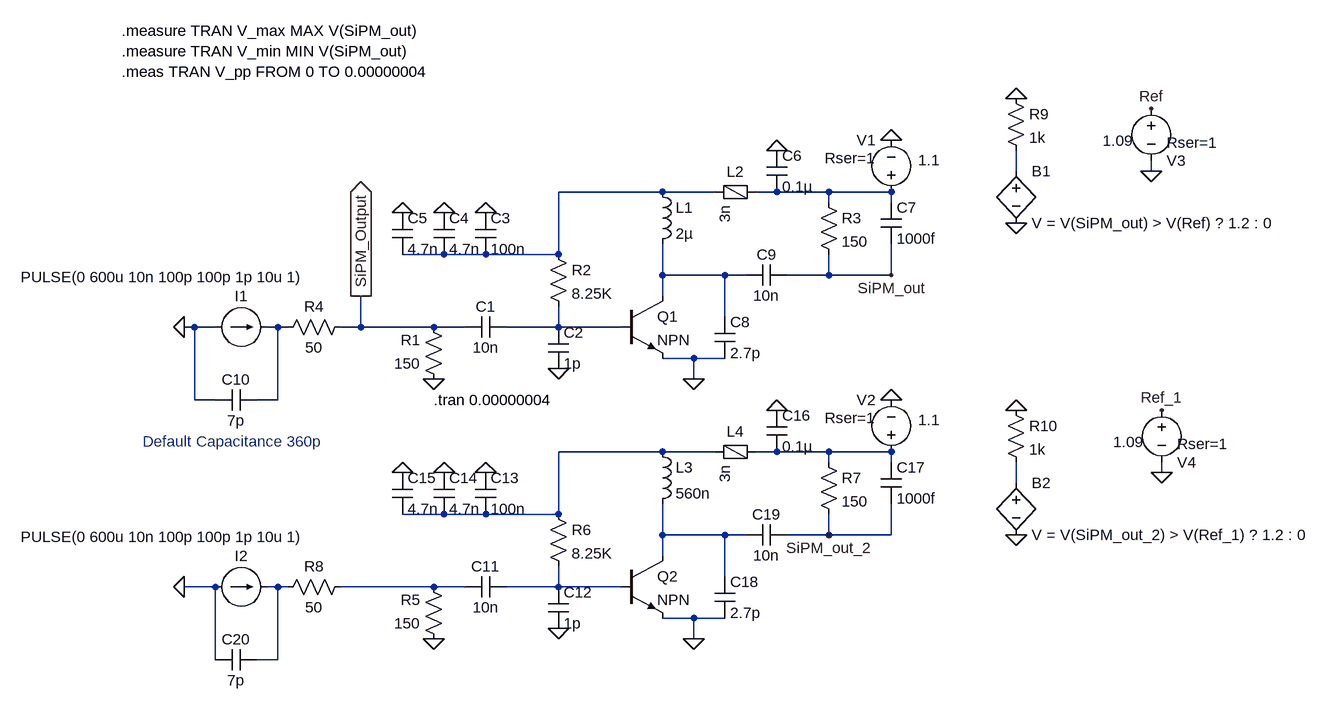
[diagram p0: schematic FARICH_TOT_Simulation.asc]
FARICH_TOT_Simulation.asc, the LTspice schematic file:
Version 4
SHEET 1 1384 896
WIRE 896 -80 896 -112
WIRE 1104 -80 1104 -96
WIRE 352 -48 192 -48
WIRE 432 -48 352 -48
WIRE 528 -48 496 -48
WIRE 608 -48 528 -48
WIRE 704 -48 608 -48
WIRE 608 -32 608 -48
WIRE 704 -32 704 -48
WIRE 16 48 -48 48
WIRE 80 48 16 48
WIRE 192 48 192 -48
WIRE 192 48 80 48
WIRE 352 80 352 32
WIRE 448 80 352 80
WIRE 480 80 448 80
WIRE 608 80 608 48
WIRE 608 80 544 80
WIRE 704 80 704 32
WIRE 704 80 608 80
WIRE 352 112 352 80
WIRE 448 144 448 80
WIRE -368 160 -384 160
WIRE -336 160 -368 160
WIRE -240 160 -256 160
WIRE -224 160 -240 160
WIRE -112 160 -112 112
WIRE -112 160 -144 160
WIRE 0 160 -112 160
WIRE 48 160 0 160
WIRE 192 160 192 128
WIRE 192 160 112 160
WIRE 288 160 192 160
WIRE 400 208 352 208
WIRE 448 208 400 208
WIRE 400 240 400 208
WIRE -368 272 -368 160
WIRE -336 272 -368 272
WIRE -240 272 -240 160
WIRE -240 272 -272 272
WIRE 352 352 192 352
WIRE 432 352 352 352
WIRE 528 352 496 352
WIRE 608 352 528 352
WIRE 704 352 608 352
WIRE 608 368 608 352
WIRE 704 368 704 352
WIRE 1120 384 1120 368
WIRE 896 400 896 368
WIRE 16 448 -48 448
WIRE 80 448 16 448
WIRE 192 448 192 352
WIRE 192 448 80 448
WIRE 352 480 352 432
WIRE 448 480 352 480
WIRE 480 480 448 480
WIRE 608 480 608 448
WIRE 608 480 544 480
WIRE 704 480 704 432
WIRE 704 480 608 480
WIRE 352 512 352 480
WIRE 448 544 448 480
WIRE -336 560 -384 560
WIRE -240 560 -256 560
WIRE -224 560 -240 560
WIRE 0 560 -144 560
WIRE 48 560 0 560
WIRE 192 560 192 528
WIRE 192 560 112 560
WIRE 288 560 192 560
WIRE 400 608 352 608
WIRE 448 608 400 608
WIRE 400 640 400 608
WIRE -336 672 -336 560
WIRE -240 672 -240 560
WIRE -240 672 -272 672
FLAG 400 240 0
FLAG 192 224 0
FLAG 0 240 0
FLAG -48 -16 0
FLAG 16 -16 0
FLAG 80 -16 0
FLAG 528 -112 0
FLAG 704 -128 0
FLAG -384 160 0
FLAG 400 640 0
FLAG 192 624 0
FLAG 0 640 0
FLAG -48 384 0
FLAG 16 384 0
FLAG 80 384 0
FLAG 528 288 0
FLAG 704 272 0
FLAG -384 560 0
FLAG 704 80 SiPM_out
FLAG 1104 -80 0
FLAG 1104 -176 Ref
FLAG 896 0 0
FLAG 896 -192 0
FLAG 608 480 SiPM_out_2
FLAG 896 480 0
FLAG 896 288 0
FLAG 1120 384 0
FLAG 1120 288 Ref_1
FLAG -112 112 SiPM_Output
IOPIN -112 112 Out
SYMBOL npn3 288 112 R0
SYMATTR InstName Q1
SYMBOL res 16 256 R180
WINDOW 0 36 76 Left 2
WINDOW 3 36 40 Left 2
SYMATTR InstName R1
SYMATTR Value 150
SYMBOL cap 112 144 R90
WINDOW 0 0 32 VBottom 2
WINDOW 3 32 32 VTop 2
SYMATTR InstName C1
SYMATTR Value 10n
SYMBOL res 176 32 R0
SYMATTR InstName R2
SYMATTR Value 8.25K
SYMATTR SpiceLine tol=1 pwr=0.1
SYMBOL cap 176 160 R0
SYMATTR InstName C2
SYMATTR Value 1p
SYMATTR SpiceLine V=25 Irms=0 Rser=0.734 Lser=380p mfg="W�rth Elektronik" pn="885012005034 WCAP-CSGP 0402" type="NP0"
SYMBOL cap 64 -16 R0
SYMATTR InstName C3
SYMATTR Value 100n
SYMBOL cap 0 -16 R0
SYMATTR InstName C4
SYMATTR Value 4.7n
SYMBOL cap -64 -16 R0
SYMATTR InstName C5
SYMATTR Value 4.7n
SYMBOL ind 336 -64 R0
SYMATTR InstName L1
SYMATTR Value 2µ
SYMATTR SpiceLine Ipk=1.3 Rser=0.095 Rpar=2487.88 Cpar=0 mfg="Bourns, Inc." pn="SRU3014-2R0Y"
SYMBOL cap 512 -112 R0
SYMATTR InstName C6
SYMATTR Value 0.1µ
SYMATTR SpiceLine V=4 Irms=0 Rser=0 Lser=0 mfg="Murata" pn="GRM022R60G153KE15" type="X5R"
SYMBOL res 592 -48 R0
SYMATTR InstName R3
SYMATTR Value 150
SYMATTR SpiceLine tol=1 pwr=0.1
SYMBOL cap 688 -32 R0
SYMATTR InstName C7
SYMATTR Value 1000f
SYMATTR SpiceLine V=25 Irms=0 Rser=0.734 Lser=380p mfg="W�rth Elektronik" pn="885012005034 WCAP-CSGP 0402" type="NP0"
SYMBOL cap 432 144 R0
SYMATTR InstName C8
SYMATTR Value 2.7p
SYMATTR SpiceLine V=25 Irms=0 Rser=0 Lser=0
SYMBOL cap 544 64 R90
WINDOW 0 0 32 VBottom 2
WINDOW 3 32 32 VTop 2
SYMATTR InstName C9
SYMATTR Value 10n
SYMATTR SpiceLine V=6.3 Irms=25.7m Rser=3.62516 Lser=0
SYMBOL voltage 704 -32 R180
WINDOW 0 24 96 Left 2
WINDOW 3 -75 65 Left 2
WINDOW 123 0 0 Left 0
WINDOW 39 24 68 Left 2
SYMATTR InstName V1
SYMATTR Value 1.1
SYMATTR SpiceLine Rser=1
SYMBOL FerriteBead 464 -48 R90
WINDOW 0 -16 0 VBottom 2
SYMATTR InstName L2
SYMATTR Value 3n
SYMATTR SpiceLine Ipk=2 Rser=0.064 Rpar=620 Cpar=1.1p mfg="W�rth Elektronik" pn="782763621 WE-CBA 1206"
SYMBOL current -336 160 R270
WINDOW 0 32 40 VTop 2
WINDOW 3 93 -80 VBottom 2
WINDOW 123 0 0 Left 0
WINDOW 39 0 0 Left 0
SYMATTR InstName I1
SYMATTR Value PULSE(0 600u 10n 100p 100p 1p 10u 1)
SYMBOL res -128 144 R90
WINDOW 0 0 56 VBottom 2
WINDOW 3 32 56 VTop 2
SYMATTR InstName R4
SYMATTR Value 50
SYMBOL cap -272 256 R90
WINDOW 0 0 32 VBottom 2
WINDOW 3 32 32 VTop 2
SYMATTR InstName C10
SYMATTR Value 7p
SYMBOL npn3 288 512 R0
SYMATTR InstName Q2
SYMBOL res 16 656 R180
WINDOW 0 36 76 Left 2
WINDOW 3 36 40 Left 2
SYMATTR InstName R5
SYMATTR Value 150
SYMBOL cap 112 544 R90
WINDOW 0 0 32 VBottom 2
WINDOW 3 32 32 VTop 2
SYMATTR InstName C11
SYMATTR Value 10n
SYMBOL res 176 432 R0
SYMATTR InstName R6
SYMATTR Value 8.25K
SYMATTR SpiceLine tol=1 pwr=0.1
SYMBOL cap 176 560 R0
SYMATTR InstName C12
SYMATTR Value 1p
SYMATTR SpiceLine V=25 Irms=0 Rser=0.734 Lser=380p mfg="W�rth Elektronik" pn="885012005034 WCAP-CSGP 0402" type="NP0"
SYMBOL cap 64 384 R0
SYMATTR InstName C13
SYMATTR Value 100n
SYMBOL cap 0 384 R0
SYMATTR InstName C14
SYMATTR Value 4.7n
SYMBOL cap -64 384 R0
SYMATTR InstName C15
SYMATTR Value 4.7n
SYMBOL ind 336 336 R0
SYMATTR InstName L3
SYMATTR Value 560n
SYMATTR SpiceLine Ipk=1.3 Rser=0.095 Rpar=2487.88 Cpar=0
SYMBOL cap 512 288 R0
SYMATTR InstName C16
SYMATTR Value 0.1µ
SYMATTR SpiceLine V=4 Irms=0 Rser=0 Lser=0 mfg="Murata" pn="GRM022R60G153KE15" type="X5R"
SYMBOL res 592 352 R0
SYMATTR InstName R7
SYMATTR Value 150
SYMATTR SpiceLine tol=1 pwr=0.1
SYMBOL cap 688 368 R0
SYMATTR InstName C17
SYMATTR Value 1000f
SYMATTR SpiceLine V=25 Irms=0 Rser=0.734 Lser=380p mfg="W�rth Elektronik" pn="885012005034 WCAP-CSGP 0402" type="NP0"
SYMBOL cap 432 544 R0
SYMATTR InstName C18
SYMATTR Value 2.7p
SYMATTR SpiceLine V=25 Irms=0 Rser=0 Lser=0
SYMBOL cap 544 464 R90
WINDOW 0 0 32 VBottom 2
WINDOW 3 32 32 VTop 2
SYMATTR InstName C19
SYMATTR Value 10n
SYMATTR SpiceLine V=6.3 Irms=25.7m Rser=3.62516 Lser=0
SYMBOL voltage 704 368 R180
WINDOW 0 24 96 Left 2
WINDOW 3 -75 65 Left 2
WINDOW 123 0 0 Left 0
WINDOW 39 24 68 Left 2
SYMATTR InstName V2
SYMATTR Value 1.1
SYMATTR SpiceLine Rser=1
SYMBOL FerriteBead 464 352 R90
WINDOW 0 -16 0 VBottom 2
SYMATTR InstName L4
SYMATTR Value 3n
SYMATTR SpiceLine Ipk=2 Rser=0.064 Rpar=620 Cpar=1.1p mfg="W�rth Elektronik" pn="782763621 WE-CBA 1206"
SYMBOL current -336 560 R270
WINDOW 0 32 40 VTop 2
WINDOW 3 93 -80 VBottom 2
WINDOW 123 0 0 Left 0
WINDOW 39 0 0 Left 0
SYMATTR InstName I2
SYMATTR Value PULSE(0 600u 10n 100p 100p 1p 10u 1)
SYMBOL res -128 544 R90
WINDOW 0 0 56 VBottom 2
WINDOW 3 32 56 VTop 2
SYMATTR InstName R8
SYMATTR Value 50
SYMBOL cap -272 656 R90
WINDOW 0 0 32 VBottom 2
WINDOW 3 32 32 VTop 2
SYMATTR InstName C20
SYMATTR Value 7p
SYMBOL bv 896 -96 R0
SYMATTR InstName B1
SYMATTR Value V = V(SiPM_out) > V(Ref) ? 1.2 : 0
SYMBOL voltage 1104 -192 R0
WINDOW 0 24 96 Left 2
WINDOW 3 -75 65 Left 2
WINDOW 123 0 0 Left 0
WINDOW 39 24 68 Left 2
SYMATTR InstName V3
SYMATTR Value 1.09
SYMATTR SpiceLine Rser=1
SYMBOL res 880 -208 R0
SYMATTR InstName R9
SYMATTR Value 1k
SYMBOL bv 896 384 R0
SYMATTR InstName B2
SYMATTR Value V = V(SiPM_out_2) > V(Ref_1) ? 1.2 : 0
SYMBOL res 880 272 R0
SYMATTR InstName R10
SYMATTR Value 1k
SYMBOL voltage 1120 272 R0
WINDOW 0 24 96 Left 2
WINDOW 3 -75 65 Left 2
WINDOW 123 0 0 Left 0
WINDOW 39 24 68 Left 2
SYMATTR InstName V4
SYMATTR Value 1.09
SYMATTR SpiceLine Rser=1
TEXT 0 272 Left 2 !.tran 0.00000004
TEXT -448 336 Left 2 ;Default Capacitance 360p
TEXT -480 -296 Left 2 !.measure TRAN V_max MAX V(SiPM_out)\n.measure TRAN V_min MIN V(SiPM_out)\n.meas TRAN V_pp FROM 0 TO 0.00000004

The netlist it stands for:
* FARICH_TOT_Simulation.asc
Q1 N004 N006 0 0 NPN
R1 0 SiPM_Output 150
C1 N006 SiPM_Output 10n
R2 N002 N006 8.25K tol=1 pwr=0.1
C2 N006 0 1p V=25 Irms=0 Rser=0.734 Lser=380p mfg="W�rth Elektronik" pn="885012005034 WCAP-CSGP 0402" type="NP0"
C3 0 N002 100n
C4 0 N002 4.7n
C5 0 N002 4.7n
L1 N002 N004 2µ Ipk=1.3 Rser=0.095 Rpar=2487.88 Cpar=0 mfg="Bourns, Inc." pn="SRU3014-2R0Y"
C6 0 N003 0.1µ V=4 Irms=0 Rser=0 Lser=0 mfg="Murata" pn="GRM022R60G153KE15" type="X5R"
R3 N003 SiPM_out 150 tol=1 pwr=0.1
C7 N003 SiPM_out 1000f V=25 Irms=0 Rser=0.734 Lser=380p mfg="W�rth Elektronik" pn="885012005034 WCAP-CSGP 0402" type="NP0"
C8 N004 0 2.7p V=25 Irms=0 Rser=0 Lser=0
C9 SiPM_out N004 10n V=6.3 Irms=25.7m Rser=3.62516 Lser=0
V1 N003 0 1.1 Rser=1
L2 N003 N002 3n Ipk=2 Rser=0.064 Rpar=620 Cpar=1.1p mfg="W�rth Elektronik" pn="782763621 WE-CBA 1206"
I1 0 N005 PULSE(0 600u 10n 100p 100p 1p 10u 1)
R4 SiPM_Output N005 50
C10 N005 0 7p
Q2 N010 N013 0 0 NPN
R5 0 N012 150
C11 N013 N012 10n
R6 N007 N013 8.25K tol=1 pwr=0.1
C12 N013 0 1p V=25 Irms=0 Rser=0.734 Lser=380p mfg="W�rth Elektronik" pn="885012005034 WCAP-CSGP 0402" type="NP0"
C13 0 N007 100n
C14 0 N007 4.7n
C15 0 N007 4.7n
L3 N007 N010 560n Ipk=1.3 Rser=0.095 Rpar=2487.88 Cpar=0
C16 0 N008 0.1µ V=4 Irms=0 Rser=0 Lser=0 mfg="Murata" pn="GRM022R60G153KE15" type="X5R"
R7 N008 SiPM_out_2 150 tol=1 pwr=0.1
C17 N008 SiPM_out_2 1000f V=25 Irms=0 Rser=0.734 Lser=380p mfg="W�rth Elektronik" pn="885012005034 WCAP-CSGP 0402" type="NP0"
C18 N010 0 2.7p V=25 Irms=0 Rser=0 Lser=0
C19 SiPM_out_2 N010 10n V=6.3 Irms=25.7m Rser=3.62516 Lser=0
V2 N008 0 1.1 Rser=1
L4 N008 N007 3n Ipk=2 Rser=0.064 Rpar=620 Cpar=1.1p mfg="W�rth Elektronik" pn="782763621 WE-CBA 1206"
I2 0 N011 PULSE(0 600u 10n 100p 100p 1p 10u 1)
R8 N012 N011 50
C20 N011 0 7p
B1 N001 0 V = V(SiPM_out) > V(Ref) ? 1.2 : 0
V3 Ref 0 1.09 Rser=1
R9 0 N001 1k
B2 N009 0 V = V(SiPM_out_2) > V(Ref_1) ? 1.2 : 0
R10 0 N009 1k
V4 Ref_1 0 1.09 Rser=1
.model NPN NPN
.model PNP PNP
.lib standard.bjt
.tran 0.00000004
* Default Capacitance 360p
.measure TRAN V_max MAX V(SiPM_out)
.measure TRAN V_min MIN V(SiPM_out)
.meas TRAN V_pp FROM 0 TO 0.00000004
.backanno
.end